# EAGLE design Grove Electromagnet v1.0 (EAGLE 6.4)
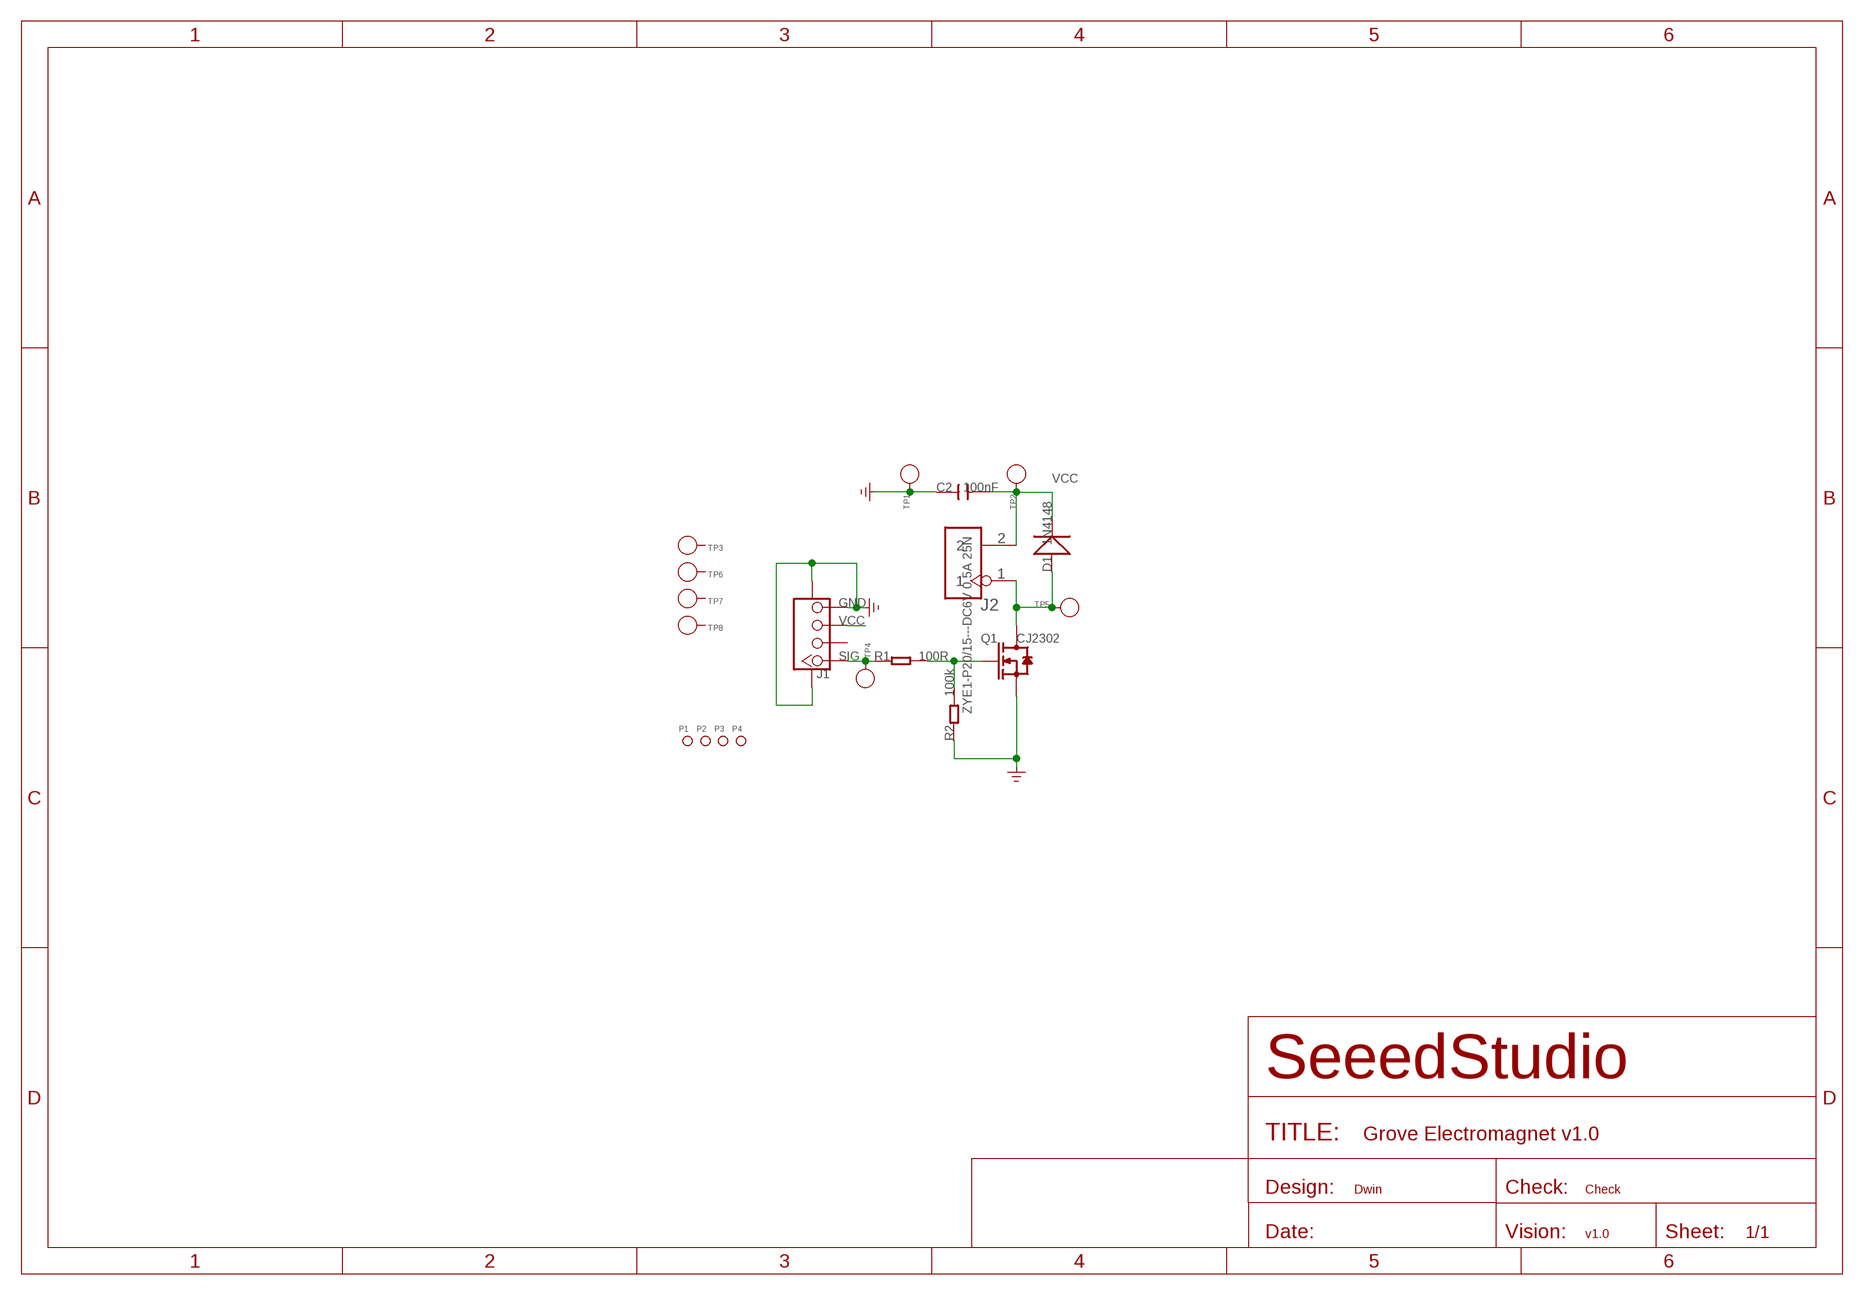
[diagram p0: schematic, sheet 1]

## Parts
C2  100nF  C-0603  [C0603]
D1  1N4148  D'1N4148-SMD'  [LL-34]
J1  TWIG-4P-2.0-SMD-FEMALE-REINFORCE'DD'  [4P-SMD-2.0]
J2  ZYE1-P20/15---DC6V 0.5A 25N  HEADER-2P-65/35MIL  [2P-2.54-65/35MIL]
P1  PAD-MARK  [ROUND-MARK-1.0]
P2  PAD-MARK  [ROUND-MARK-1.0]
P3  PAD-MARK  [ROUND-MARK-1.0]
P4  PAD-MARK  [ROUND-MARK-1.0]
Q1  CJ2302  MOSFET-N'SOT23'  [SOT23]
R1  100R  R-0603  [R0603]
R2  100k  R-0603  [R0603]
TP1  PAD-TEST-POINT'4545'  [TP_4545]
TP2  PAD-TEST-POINT'4545'  [TP_4545]
TP3  PAD-TEST-POINT'4545'  [TP_4545]
TP4  PAD-TEST-POINT'4545'  [TP_4545]
TP5  PAD-TEST-POINT'4545'  [TP_4545]
TP6  PAD-TEST-POINT'4545'  [TP_4545]
TP7  PAD-TEST-POINT'4545'  [TP_4545]
TP8  PAD-TEST-POINT'4545'  [TP_4545]

## Nets
GND: C2.1 J1.4 J1.SS1 J1.SS2 Q1.2(S) R2.1 TP1.T
N$2: Q1.1(G) R1.2 R2.2
N$5: D1.A(+) J2.1 Q1.3(D) TP5.T
SIG: J1.1 R1.1 TP4.T
VCC: C2.2 D1.C(-) J1.3 J2.2 TP2.T
Unconnected: J1.2 TP3.T TP6.T TP7.T TP8.T

## Notes on the sheet
- Dwin | Check
- v1.0

## Library data of the parts
C2 = Discrete:C*: Ceramic Capacitors
D1 = Discrete:D*
J1 = Connector :TWIG-4P-2.0-SMD-FEMALE-REINFORCE
J2 = Connector :HEADER-2P
P1-P4 = Discrete:PAD-MARK; PARTNO: DNP
Q1 = Discrete:MOSFET-N: IRLL014: http://www.vishay.com/docs/91319/sihll014.pdf
R1 R2 = Discrete:R*
TP1-TP8 = Discrete:PAD-TEST-POINT; PARTNO: DNP

## Board
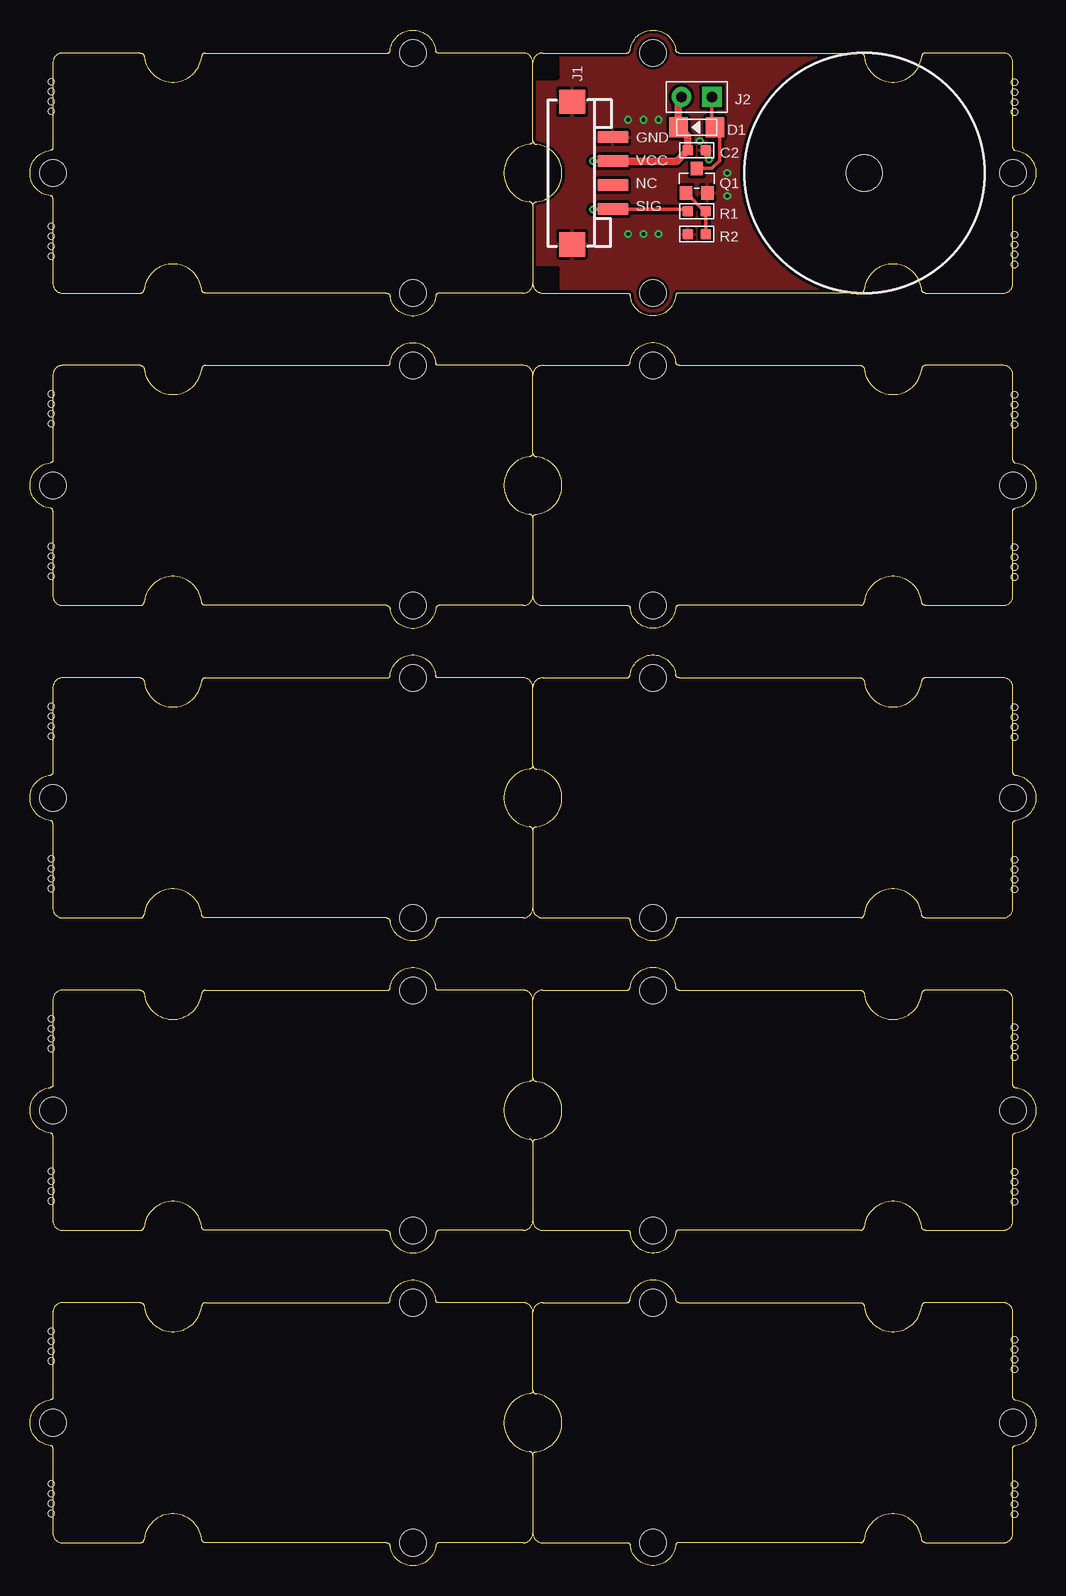
[diagram p1: board, top side]
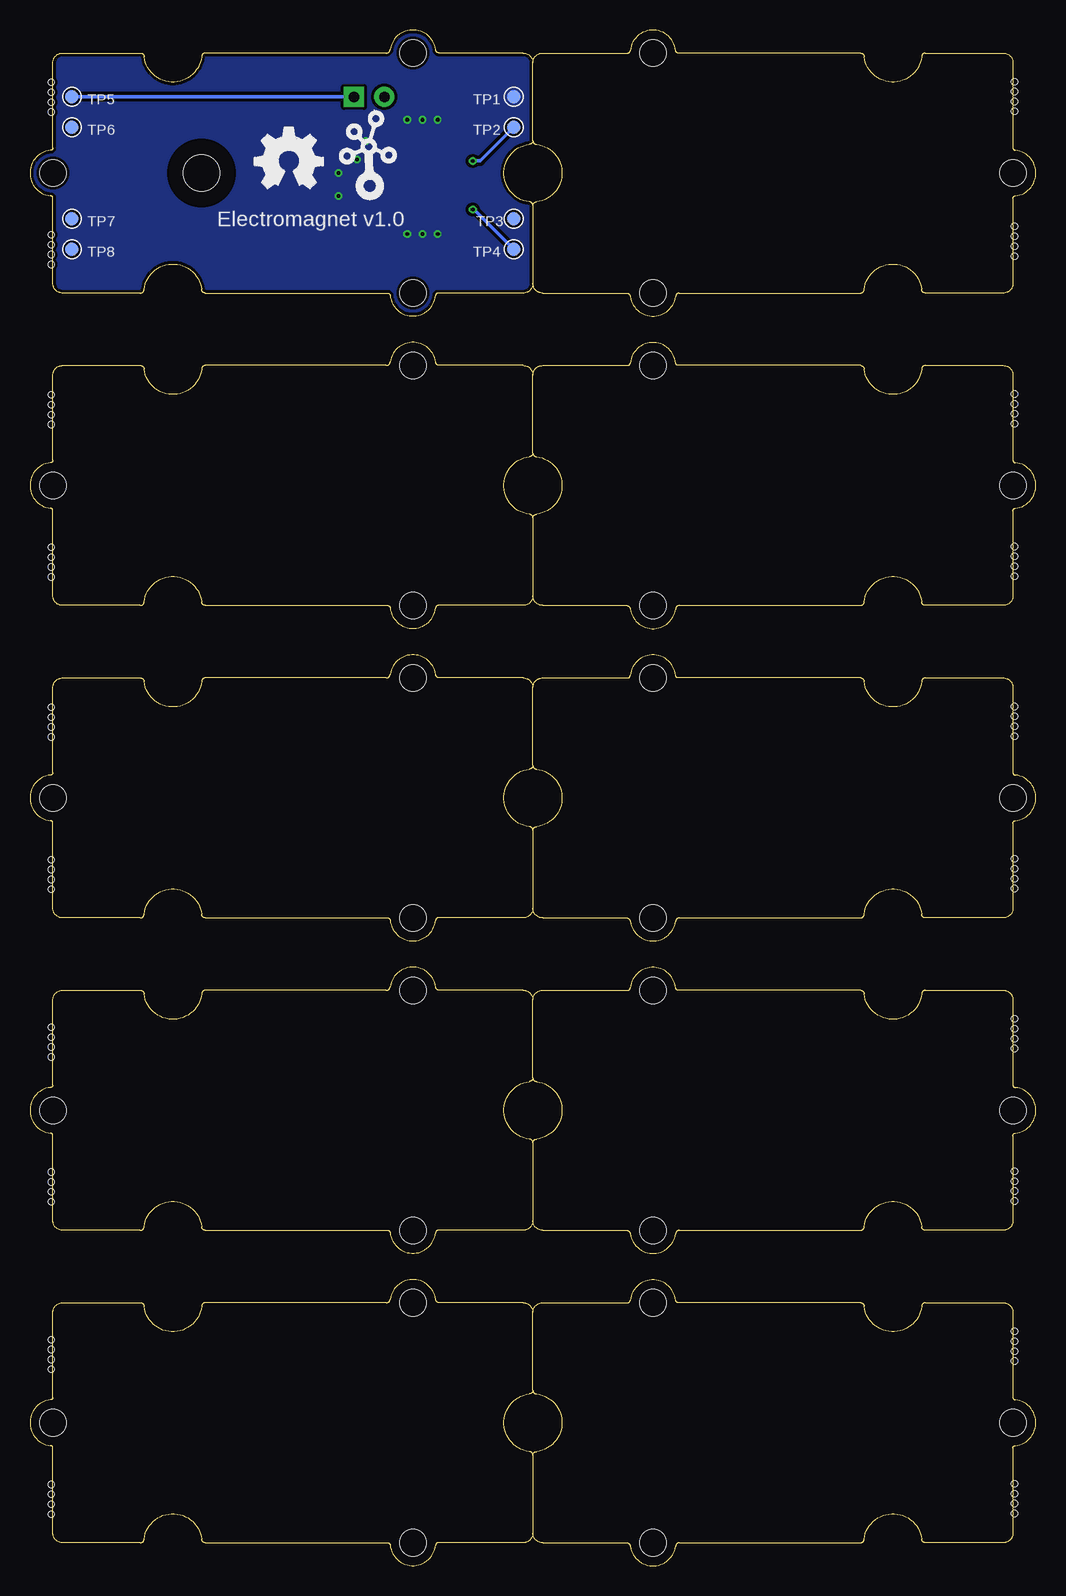
[diagram p2: board, bottom side, seen from below]

Size 83.82 x 127.98 mm. Coordinates in mm from the lower left corner, seen from the top.
Copper layers (1*16): Top 0.035mm / dielectric 1.5mm / Bottom 0.035mm
Design rules "SeeedStudio_DRU_no_angle_20130527 *": minimum track width 6mil, minimum drill 12mil, track to track 6mil, track to pad 6mil, pad to pad 6mil, via to via 6mil, smd to smd 0mil, copper to edge 10mil, drill to drill 10mil, minimum pad ring 10mil, minimum via ring 6mil, stop-mask expansion 2mil, vias tented up to drill 25mil, thermal gap 10mil
Holes 3 mm at 69.53,116.06
Holes 0.5 mm at 1.78,32.88 1.78,30.4 1.78,31.23 1.78,32.05 1.78,45.58 1.78,43.1 1.78,43.93 1.78,44.75 1.78,58.91 1.78,56.43 1.78,57.26 1.78,58.09 1.78,71.61 1.78,69.13 1.78,69.96 1.78,70.79 1.78,84.95 1.78,82.47 1.78,83.3 1.78,84.12 1.78,97.65 1.78,95.17 1.78,96 1.78,96.82 1.78,111.62 1.78,109.14 1.78,109.97 1.78,110.79 1.78,123.68 1.78,121.2 1.78,122.03 1.78,122.86 82.04,121.14 82.04,123.62 82.04,122.79 82.04,121.97 82.04,108.44 82.04,110.92 82.04,110.09 82.04,109.27 82.04,95.11 82.04,97.58 82.04,96.76 82.04,95.93 82.04,82.41 82.04,84.88 82.04,84.06 82.04,83.23 82.04,69.07 82.04,71.55 82.04,70.72 82.04,69.9 82.04,56.37 82.04,58.85 82.04,58.02 82.04,57.2 82.04,42.4 82.04,44.88 82.04,44.05 82.04,43.23 82.04,30.34 82.04,32.81 82.04,31.99 82.04,31.16 1.78,6.84 1.78,4.36 1.78,5.19 1.78,6.02 1.78,19.54 1.78,17.06 1.78,17.89 1.78,18.72 82.04,16.37 82.04,18.84 82.04,18.02 82.04,17.19 82.04,4.3 82.04,6.78 82.04,5.95 82.04,5.13
Holes 1.91 mm at -4.13,2.4 87.95,2.4 87.95,125.59 -4.13,125.59
tRestrict: area 59.5,106.1 to 79.5,126.1
bRestrict: area 67,113.6 to 72,118.6

### Footprints (pad centres in the part's own frame; a part is rotated, then mirrored left to right if it is on the bottom)
C0603 = smd 0.889 x 0.889: 1 -0.762,0; 2 0.762,0
LL-34 = smd 1.524 x 1.676: A -1.524,0; C 1.524,0
4P-SMD-2.0 = smd 0.965 x 2.54: 1 -3,0; 2 -1,0; 3 1,0; 4 3,0 | smd 2.032 x 2.184: SS1 -5.946,3.4; SS2 5.946,3.4
2P-2.54-65/35MIL = drill 0.889 pad 1.651 square: 1 0,1.27 | drill 0.889 pad 1.651: 2 0,-1.27
ROUND-MARK-1.0 = smd 1.016 x 1.016: P$1 0,0
SOT23 = smd 1.016 x 1.143: 1 -0.889,-1.016; 2 0.889,-1.016; 3 0,1.016
R0603 = smd 0.889 x 0.889: 1 -0.762,0; 2 0.762,0
TP_4545 = smd 1.143 x 1.143: T 0,0
GROVE-2CONNECTOR-SMD = hole 2.2: -10,-10; -10,10; 20,0

### Placement (x,y rotation side)
C2  55.56,117.97 180 top
D1  55.56,119.87 180 top
J1  48.58,116.06 90 top
J2  55.56,122.41 270 top
P1  -4.13,7.48 0 top  (outside the outline)
P2  87.95,7.48 0 top  (outside the outline)
P3  -4.13,120.51 0 top  (outside the outline)
P4  87.95,120.51 0 top  (outside the outline)
Q1  55.56,115.43 0 top
R1  55.56,112.89 0 top
R2  55.56,110.98 0 top
TP1  43.5,122.41 0 bottom
TP2  43.5,119.87 0 bottom
TP3  43.5,112.25 0 bottom
TP4  43.5,109.71 0 bottom
TP5  80.33,122.41 0 bottom
TP6  80.33,119.87 0 bottom
TP7  80.33,112.25 0 bottom
TP8  80.33,109.71 0 bottom
U$5  [GROVE-2CONNECTOR-SMD]  61.91,116.06 0 top
U$6  [TWIGLOGO]  55.56,114.79 0 bottom
U$7  [OSHW_FILLX200_NOTEXT]  65.09,114.79 0 bottom
U$8  [GROVE-2CONNECTOR-SMD]  21.91,116.06 180 top
U$9  [GROVE-2CONNECTOR-SMD]  21.91,90.03 180 top
U$10  [GROVE-2CONNECTOR-SMD]  61.91,90.03 0 top
U$11  [GROVE-2CONNECTOR-SMD]  21.91,63.99 180 top
U$12  [GROVE-2CONNECTOR-SMD]  61.91,63.99 0 top
U$13  [GROVE-2CONNECTOR-SMD]  21.91,37.96 180 top
U$14  [GROVE-2CONNECTOR-SMD]  61.91,37.96 0 top
U$15  [GROVE-2CONNECTOR-SMD]  21.91,11.92 180 top
U$16  [GROVE-2CONNECTOR-SMD]  61.91,11.92 0 top

### Tracks (layer width: path | path; a pad name or v marks a point on that pad's centre or on a via)
GND  (via drill 0.3 pad 0.64)
  Top 0.203: C2.1 56.33,117.46 v56.58,117.2
  other vias: 58.1,114.16 58.1,116.06 52.39,120.51 51.12,120.51 49.85,120.51 52.39,110.98 51.12,110.98 49.85,110.98 55.82,118.73
  pour Bottom (isolate 0.254): 41.59,128.13 84.14,128.13 84.14,104.63 84.14,104 41.59,104
  pour Top (isolate 0.254): 41.59,128.13 84.14,128.13 84.14,104.63 84.14,104 41.59,104
N$2
  Top 0.305: Q1.1 56.2,112.89 R1.2 R2.2
N$5
  Top 0.305: J2.1 56.83,120.13 D1.A 57.47,119.49 57.47,117.08 56.83,116.44 Q1.3
  Bottom 0.305: J2.1 TP5.T
SIG  (via drill 0.3 pad 0.64)
  Top 0.305: v46.93,113.01 46.98,113.06 J1.1 54.63,113.06 R1.1
  Bottom 0.305: v46.93,113.01 46.8,113.01 TP4.T
VCC  (via drill 0.3 pad 0.64)
  Top 0.305: J1.3 46.94,117.06 v46.93,117.08
  Top 0.61: J1.3 53.9,117.06 C2.2 54.8,119.11 D1.C 54.04,122.16 J2.2
  Bottom 0.305: v46.93,117.08 46.29,117.08 TP2.T

### Text on the board
tPlace: GND | VCC | NC | SIG
bPlace: Electromagnet v1.0